# EAGLE design Water_Schematic2_1 (EAGLE 9.5.2)
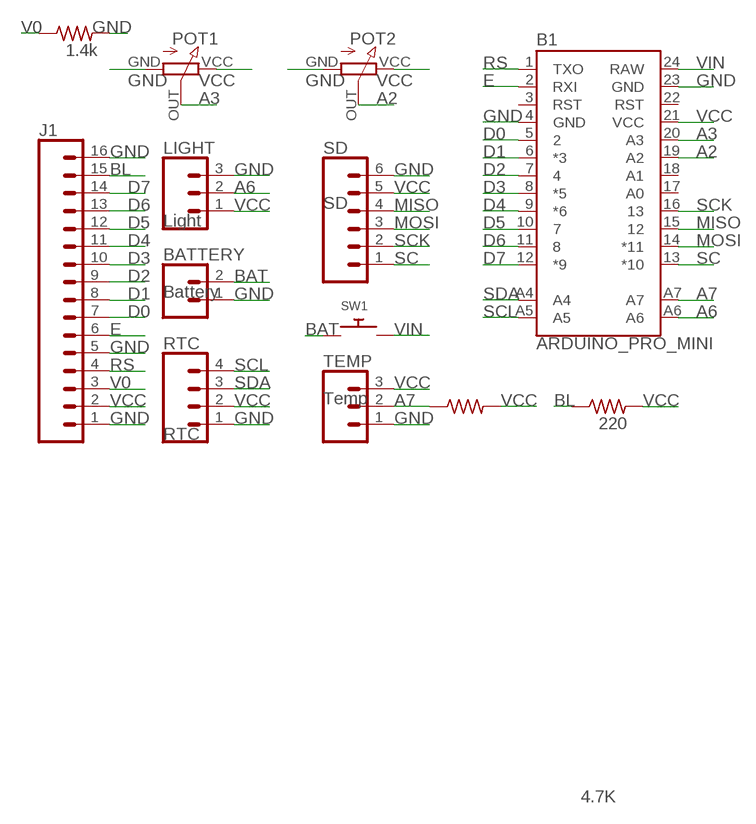
[diagram p0: schematic, sheet 1]

## Parts
B1  ARDUINO_PRO_MINI  [ARDUINO_PRO_MINI]
BATTERY  Battery  CONN_02POLAR  [MOLEX-1X2]
J1  CONN_16  [1X16]
LIGHT  Light  CONN_03  [1X03]
POT1  RM_065  [RM_065]
POT2  RM_065  [RM_065]
R1  4.7K  R-US_0204/7  [0204/7]
R2  220  R-US_0204/7  [0204/7]
R3  1.4k  R-US_0204/7  [0204/7]
RTC  RTC  CONN_04POLAR  [MOLEX-1X4]
SD  SD  CONN_06SILK_FEMALE_PTH  [1X06]
SW1  SWITCH_PUSHBUTTONEVQ-PE  [TACT_PANA-EVQ]
TEMP  Temp  CONN_03  [1X03]

## Nets
A2: B1.19(A2) POT2.OUT
A3: B1.20(A3) POT1.OUT
A6: B1.A6 LIGHT.2
A7: B1.A7 R1.1 TEMP.2
BAT: BATTERY.2 SW1.P$1
BL: J1.15 R2.1
D0: B1.5 J1.7
D1: B1.6(*3) J1.8
D2: B1.7 J1.9
D3: B1.8(*5) J1.10
D4: B1.9(*6) J1.11
D5: B1.10 J1.12
D6: B1.11 J1.13
D7: B1.12(*9) J1.14
E: B1.2(RXI) J1.6
GND: B1.4(GND) B1.23(GND) BATTERY.1 J1.1 J1.5 J1.16 LIGHT.3 POT1.GND(GROUND) POT2.GND(GROUND) R3.2 RTC.1 SD.6 TEMP.1
MISO: B1.15 SD.4
MOSI: B1.14(*11) SD.3
RS: B1.1(TXO) J1.4
SC: B1.13(*10) SD.1
SCK: B1.16 SD.2
SCL: B1.A5 RTC.4
SDA: B1.A4 RTC.3
V0: J1.3 R3.1
VCC: B1.21(VCC) J1.2 LIGHT.1 POT1.VCC POT2.VCC R1.2 R2.2 RTC.2 SD.5 TEMP.3
VIN: B1.24(RAW) SW1.P$2
Unconnected: B1.3(RST) B1.17(A0) B1.18(A1) B1.22(RST)

## Library data of the parts
B1 = SparkFun-Boards_mod:ARDUINO_PRO_MINI: SparkFun Pro Mini Pro Mini compatible footprint. Dimensions: 0.7 x 1.3" PCB Thickness: 0.8mm SparkFun Products: 3.3V/8MHz <https://www.sparkfun.com/products/11114> 5V/16MHz <https://www.sparkfun.com/products/11113>
BATTERY = SparkFun-Connectors:CONN_02: Multi connection point. Often used as Generic Header-pin footprint for 0.1 inch spaced/style header connections On any of the 0.1 inch spaced packages, you can populate with these: Break Away Headers - Straight <https://www.sparkfun.com/products/116> (PRT-00116) Break Away Male Headers - Right Angle <https://www.sparkfun.com/products/553> (PRT-00553) Female Headers <https://www.sparkfun.com/products/115> (PRT-00115) Break Away Headers - Machine Pin <https://www.sparkfun.com/products/117> (PRT-00117) Break Away Female Headers - Swiss Machine Pin <https://www.sparkfun.com/products/743> (PRT-00743) For SCREWTERMINALS and SPRING TERMINALS visit here: Screw Terimnals on SparkFun.com <https://www.sparkfun.com/search/results?term=Screw+Terminals> (5mm/3.5mm/2.54mm spacing) This device is also useful as a general connection point to wire up your design to another part of your project. Our various solder wires solder well into these plated through hole pads. Hook-Up Wire - Assortment (Stranded, 22 AWG) <https://www.sparkfun.com/products/11375> (PRT-11375) Hook-Up Wire - Assortment (Solid Core, 22 AWG) <https://www.sparkfun.com/products/11367> (PRT-11367) View the entire wire category on our website here <https://www.sparkfun.com/categories/141> Special notes: Molex polarized connector foot print use with: PRT-08233 with associated crimp pins and housings. 2.54_SCREWTERM for use with PRT-10571. 3.5mm Screw Terminal footprints for PRT-08084 5mm Screw Terminal footprints for use with PRT-08432; SF_ID: PRT-09918
J1 = SparkFun-Connectors:CONN_16: Multi connection point. Often used as Generic Header-pin footprint for 0.1 inch spaced/style header connections On any of the 0.1 inch spaced packages, you can populate with these: Break Away Headers - Straight <https://www.sparkfun.com/products/116> (PRT-00116) Break Away Male Headers - Right Angle <https://www.sparkfun.com/products/553> (PRT-00553) Female Headers <https://www.sparkfun.com/products/115> (PRT-00115) Break Away Headers - Machine Pin <https://www.sparkfun.com/products/117> (PRT-00117) Break Away Female Headers - Swiss Machine Pin <https://www.sparkfun.com/products/743> (PRT-00743) For SCREWTERMINALS and SPRING TERMINALS visit here: Screw Terimnals on SparkFun.com <https://www.sparkfun.com/search/results?term=Screw+Terminals> (5mm/3.5mm/2.54mm spacing) This device is also useful as a general connection point to wire up your design to another part of your project. Our various solder wires solder well into these plated through hole pads. Hook-Up Wire - Assortment (Stranded, 22 AWG) <https://www.sparkfun.com/products/11375> (PRT-11375) Hook-Up Wire - Assortment (Solid Core, 22 AWG) <https://www.sparkfun.com/products/11367> (PRT-11367) View the entire wire category on our website here <https://www.sparkfun.com/categories/141> Special notes: Molex polarized connector foot print use with SKU : PRT-08231 with associated crimp pins and housings. 1MM SMD Version SKU: PRT-10208 NOTES ON THE VARIANTS LOCK and LOCK_LONGPADS... This footprint was designed to help hold the alignment of a through-hole component (i.e. 6-pin header) while soldering it into place. You may notice that each hole has been shifted either up or down by 0.005 of an inch from it's more standard position (which is a perfectly straight line). This slight alteration caused the pins (the squares in the middle) to touch the edges of the holes. Because they are alternating, it causes a "brace" to hold the component in place. 0.005 has proven to be the perfect amount of "off-center" position when using our standard breakaway headers. Although looks a little odd when you look at the bare footprint, once you have a header in there, the alteration is very hard to notice. Also,if you push a header all the way into place, it is covered up entirely on the bottom side.
LIGHT TEMP = SparkFun-Connectors:CONN_03: Multi connection point. Often used as Generic Header-pin footprint for 0.1 inch spaced/style header connections On any of the 0.1 inch spaced packages, you can populate with these: Break Away Headers - Straight <https://www.sparkfun.com/products/116> (PRT-00116) Break Away Male Headers - Right Angle <https://www.sparkfun.com/products/553> (PRT-00553) Female Headers <https://www.sparkfun.com/products/115> (PRT-00115) Break Away Headers - Machine Pin <https://www.sparkfun.com/products/117> (PRT-00117) Break Away Female Headers - Swiss Machine Pin <https://www.sparkfun.com/products/743> (PRT-00743) Stackable Header - 3 Pin (Female, 0.1") <https://www.sparkfun.com/products/13875> (PRT-13875) For SCREWTERMINALS and SPRING TERMINALS visit here: Screw Terimnals on SparkFun.com <https://www.sparkfun.com/search/results?term=Screw+Terminals> (5mm/3.5mm/2.54mm spacing) This device is also useful as a general connection point to wire up your design to another part of your project. Our various solder wires solder well into these plated through hole pads. Hook-Up Wire - Assortment (Stranded, 22 AWG) <https://www.sparkfun.com/products/11375> (PRT-11375) Hook-Up Wire - Assortment (Solid Core, 22 AWG) <https://www.sparkfun.com/products/11367> (PRT-11367) View the entire wire category on our website here <https://www.sparkfun.com/categories/141> Special notes: Molex polarized connector foot print use with SKU : PRT-08232 with associated crimp pins and housings.; PROD_ID: XXX-00000; VALUE: 455-1750-1-ND
POT1 POT2 = RM_065:RM_065: Small blue and white potentiometer we use in class. RM_065
R1-R3 = rcl:R-US_: RESISTOR, American symbol; SPICEPREFIX: R
RTC = SparkFun-Connectors:CONN_04: Multi connection point. Often used as Generic Header-pin footprint for 0.1 inch spaced/style header connections On any of the 0.1 inch spaced packages, you can populate with these: Break Away Headers - Straight <https://www.sparkfun.com/products/116> (PRT-00116) Break Away Male Headers - Right Angle <https://www.sparkfun.com/products/553> (PRT-00553) Female Headers <https://www.sparkfun.com/products/115> (PRT-00115) Break Away Headers - Machine Pin <https://www.sparkfun.com/products/117> (PRT-00117) Break Away Female Headers - Swiss Machine Pin <https://www.sparkfun.com/products/743> (PRT-00743) For SCREWTERMINALS and SPRING TERMINALS visit here: Screw Terimnals on SparkFun.com <https://www.sparkfun.com/search/results?term=Screw+Terminals> (5mm/3.5mm/2.54mm spacing) This device is also useful as a general connection point to wire up your design to another part of your project. Our various solder wires solder well into these plated through hole pads. Hook-Up Wire - Assortment (Stranded, 22 AWG) <https://www.sparkfun.com/products/11375> (PRT-11375) Hook-Up Wire - Assortment (Solid Core, 22 AWG) <https://www.sparkfun.com/products/11367> (PRT-11367) View the entire wire category on our website here <https://www.sparkfun.com/categories/141> Special notes: Molex polarized connector foot print use with SKU : PRT-08231 with associated crimp pins and housings. 1MM SMD Version SKU: PRT-10208; PROD_ID: CONN-08186; SF_ID: PRT-08231
SD = SparkFun-Connectors:CONN_06: Multi connection point. Often used as Generic Header-pin footprint for 0.1 inch spaced/style header connections On any of the 0.1 inch spaced packages, you can populate with these: Break Away Headers - Straight <https://www.sparkfun.com/products/116> (PRT-00116) Break Away Male Headers - Right Angle <https://www.sparkfun.com/products/553> (PRT-00553) Female Headers <https://www.sparkfun.com/products/115> (PRT-00115) Break Away Headers - Machine Pin <https://www.sparkfun.com/products/117> (PRT-00117) Break Away Female Headers - Swiss Machine Pin <https://www.sparkfun.com/products/743> (PRT-00743) Arduino Stackable Header - 6 Pin <https://www.sparkfun.com/products/9280> (PRT-09280) For SCREWTERMINALS and SPRING TERMINALS visit here: Screw Terimnals on SparkFun.com <https://www.sparkfun.com/search/results?term=Screw+Terminals> (5mm/3.5mm/2.54mm spacing) This device is also useful as a general connection point to wire up your design to another part of your project. Our various solder wires solder well into these plated through hole pads. Hook-Up Wire - Assortment (Stranded, 22 AWG) <https://www.sparkfun.com/products/11375> (PRT-11375) Hook-Up Wire - Assortment (Solid Core, 22 AWG) <https://www.sparkfun.com/products/11367> (PRT-11367) View the entire wire category on our website here <https://www.sparkfun.com/categories/141>; PROD_ID: CONN-08437
SW1 = adafruit:SWITCH_PUSHBUTTON: Buttons SOFTTOUCHSMD_SJ - Soft touch temporary push button (Super Junk Akihabara) Compatible with SKPMANE010 [Mouser: 688-SKPMAN] C&K_KSS = Digikey: KSS221GLFS

## Board
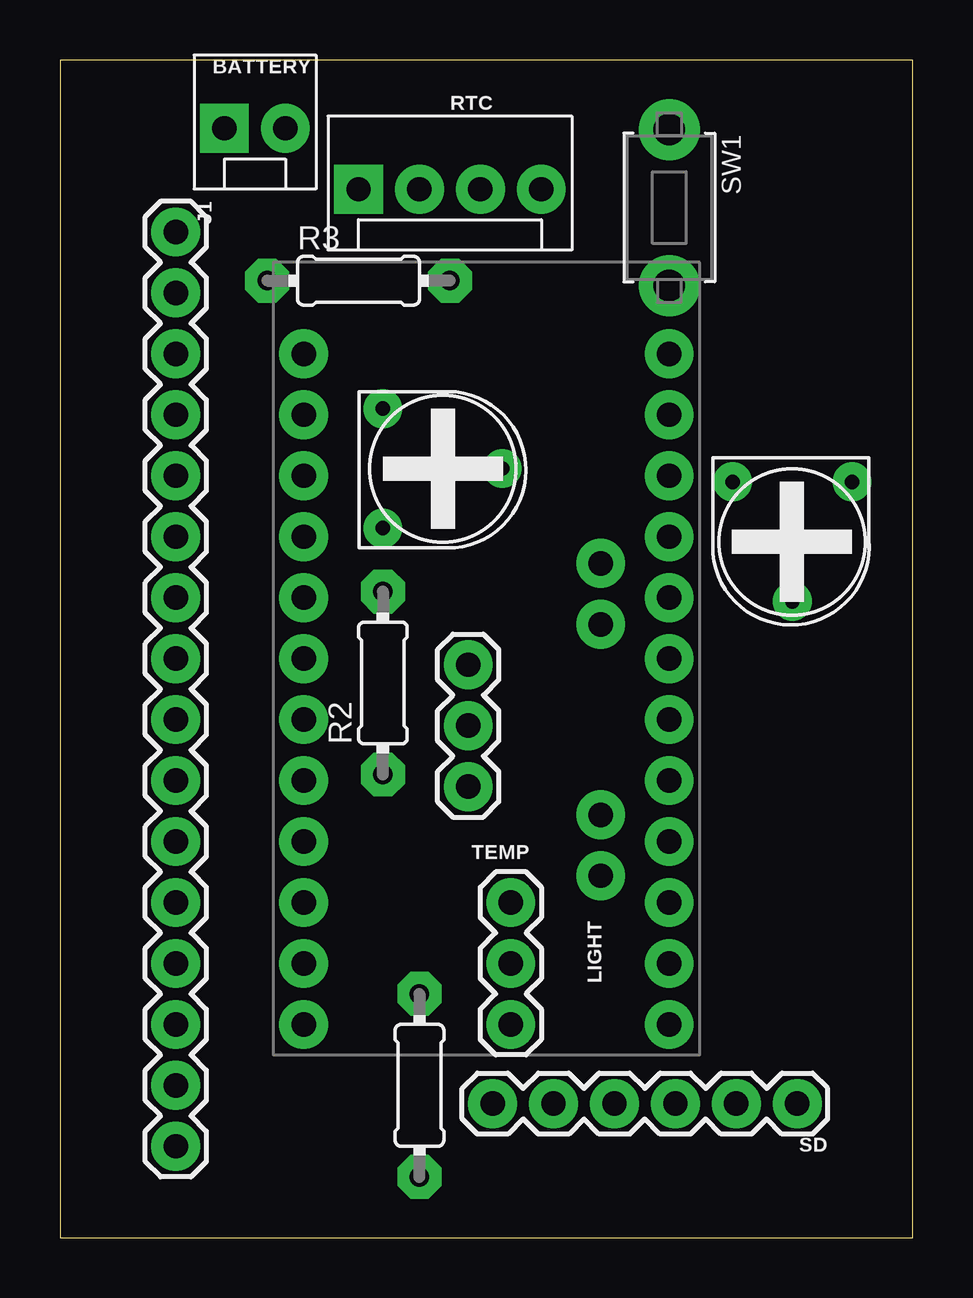
[diagram p1: board, top side]
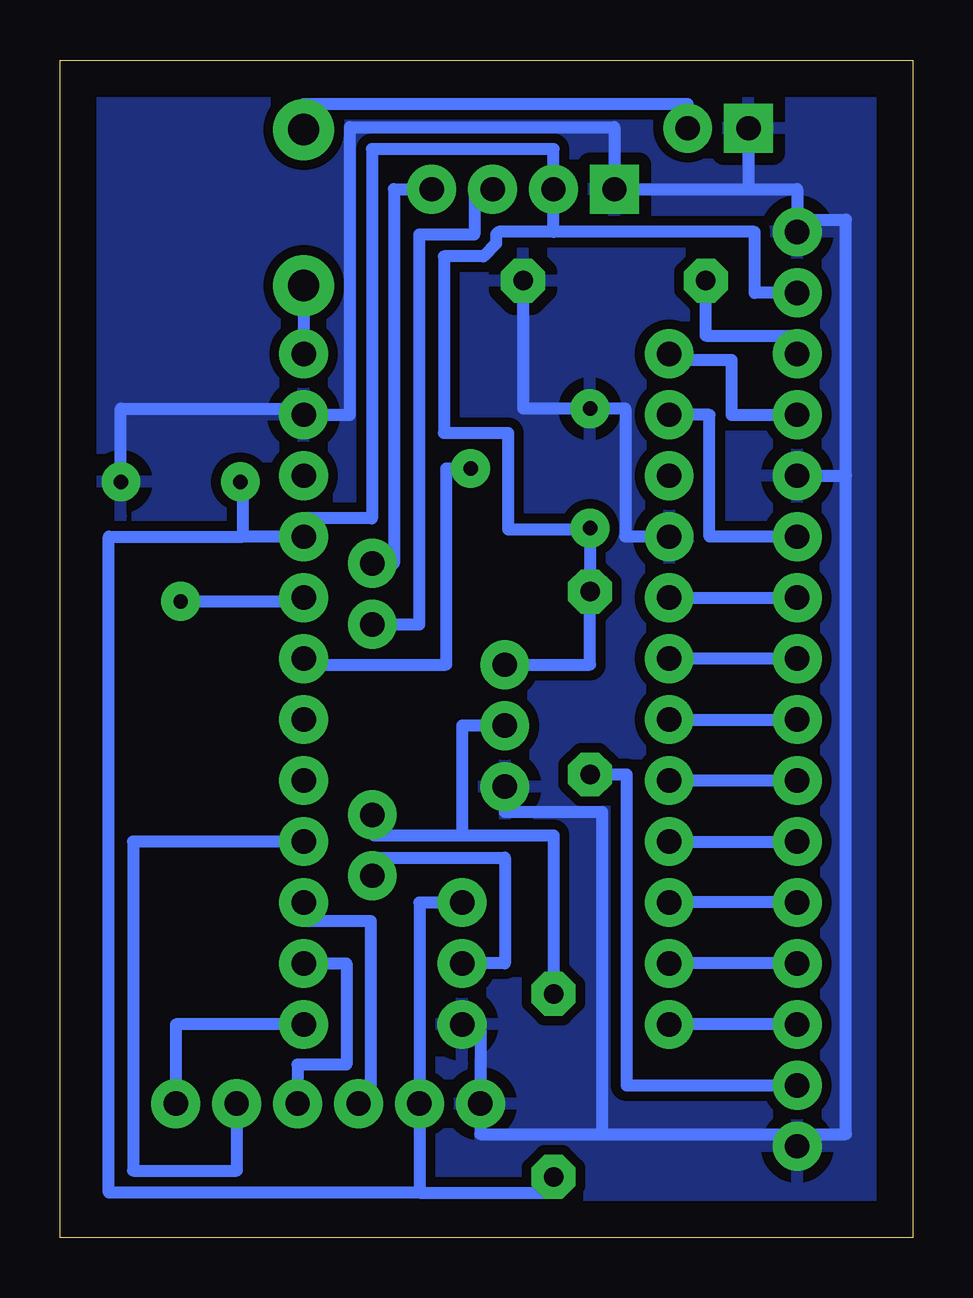
[diagram p2: board, bottom side, seen from below]

Size 35.56 x 49.07 mm. Coordinates in mm from the lower left corner, seen from the top.
Outline: 0,0 35.56,0 35.56,49.07 0,49.07 0,0
Copper layers (1*16): Top 0mil / dielectric 1.5mm / Bottom 0.035mm
Design rules "tad265_drc": minimum track width 20mil, minimum drill 0.35mm, track to track 16mil, track to pad 16mil, pad to pad 16mil, via to via 16mil, smd to smd 16mil, copper to edge 60mil, drill to drill 16mil, minimum pad ring 20mil, minimum via ring 15mil, stop-mask expansion 8mil, vias tented up to drill 0mil, thermal gap 20mil

### Footprints (pad centres in the part's own frame; a part is rotated, then mirrored left to right if it is on the bottom)
ARDUINO_PRO_MINI = drill 1.016 pad 1.88: 1 -7.62,12.7; 2 -7.62,10.16; 3 -7.62,7.62; 4 -7.62,5.08; 5 -7.62,2.54; 6 -7.62,0; 7 -7.62,-2.54; 8 -7.62,-5.08; 9 -7.62,-7.62; 10 -7.62,-10.16; 11 -7.62,-12.7; 12 -7.62,-15.24; 13 7.62,-15.24; 14 7.62,-12.7; 15 7.62,-10.16; 16 7.62,-7.62; 17 7.62,-5.08; 18 7.62,-2.54; 19 7.62,0; 20 7.62,2.54; 21 7.62,5.08; 22 7.62,7.62; 23 7.62,10.16; 24 7.62,12.7; A4 4.763,1.429; A5 4.763,3.969; A6 4.763,-9.049; A7 4.763,-6.509
MOLEX-1X2 = drill 1.016 pad 1.88 square: 1 0,0 | drill 1.016 pad 1.88: 2 2.54,0
1X16 = drill 1.016 pad 1.88: 1 0,0; 2 2.54,0; 3 5.08,0; 4 7.62,0; 5 10.16,0; 6 12.7,0; 7 15.24,0; 8 17.78,0; 9 20.32,0; 10 22.86,0; 11 25.4,0; 12 27.94,0; 13 30.48,0; 14 33.02,0; 15 35.56,0; 16 38.1,0
1X03 = drill 1.016 pad 1.88: 1 0,0; 2 2.54,0; 3 5.08,0
RM_065 = drill 0.6: GND 0,0; OUT 2.489,4.978; VCC 4.978,0
0204/7 = drill 0.813 octagon: 1 -3.81,0; 2 3.81,0
MOLEX-1X4 = drill 1.016 pad 1.88 square: 1 0,0 | drill 1.016 pad 1.88: 2 2.54,0; 3 5.08,0; 4 7.62,0
1X06 = drill 1.016 pad 1.88: 1 0,0; 2 2.54,0; 3 5.08,0; 4 7.62,0; 5 10.16,0; 6 12.7,0
TACT_PANA-EVQ = drill 1.3 pad 2.54: P$1 -3.25,0; P$2 3.25,0

### Placement (x,y rotation side)
B1  17.78,24.13 0 top
BATTERY  6.86,46.23 0 top
J1  4.83,41.91 270 top
LIGHT  18.8,13.97 270 top
POT1  33.02,31.5 180 top
POT2  13.46,34.54 270 top
R1  14.99,6.35 270 top
R2  13.46,23.11 90 top
R3  12.45,39.88 0 top
RTC  12.45,43.69 0 top
SD  30.73,5.59 180 top
SW1  25.4,42.93 270 top
TEMP  17.02,18.8 90 top

### Tracks (layer width: path | path; a pad name or v marks a point on that pad's centre or on a via)
A2
  Bottom 0.508: B1.19 25.4,23.88 19.46,23.88 19.46,32.05 POT2.OUT
A3
  Bottom 0.508: POT1.OUT 25.55,26.52 B1.20
A6
  Bottom 0.508: B1.A6 22.54,15.84 17.02,15.84 17.02,11.43 LIGHT.2
A7
  Bottom 0.508: B1.A7 22.54,16.86 22.45,16.76 18.8,16.76 | 18.8,16.76 14.99,16.76 R1.1 | TEMP.2 18.8,21.34 18.8,16.76
BAT
  Bottom 0.508: SW1.P$1 25.4,47.24 9.4,47.24 BATTERY.2
BL
  Bottom 0.508: R2.1 11.94,19.3 11.94,6.35 J1.15
D0
  Bottom 0.508: B1.5 J1.7
D1
  Bottom 0.508: J1.8 B1.6
D2
  Bottom 0.508: B1.7 J1.9
D3
  Bottom 0.508: J1.10 B1.8
D4
  Bottom 0.508: B1.9 J1.11
D5
  Bottom 0.508: J1.12 B1.10
D6
  Bottom 0.508: J1.13 B1.11
D7
  Bottom 0.508: J1.14 B1.12
E
  Bottom 0.508: B1.2 8.48,34.29 8.48,29.21 J1.6
GND
  Bottom 0.508: 6.86,43.69 RTC.1 12.45,46.28 23.47,46.28 23.47,34.29 B1.23 25.65,34.54 33.02,34.54 POT1.GND | 2.79,31.75 2.79,4.32 4.83,4.32 | 2.79,31.75 2.79,42.42 4.83,42.42 J1.1 4.83,43.69 6.86,43.69 | 12.95,4.32 4.83,4.32 | 4.83,4.32 J1.16 | B1.4 11.99,29.21 11.99,34.54 POT2.GND 16.26,34.54 R3.2 | SD.6 18.03,4.32 12.95,4.32 | LIGHT.3 18.03,8.89 SD.6 | 18.03,5.33 SD.6 | BATTERY.1 6.86,43.69 | J1.5 2.79,31.75 | TEMP.1 17.02,17.73 12.95,17.73 12.95,4.32
  pour Bottom: 0,49.02 35.56,49.02 35.56,0 0,0
MISO
  Bottom 0.508: B1.15 25.4,13.21 22.61,13.21 22.61,5.59 SD.4
MOSI
  Bottom 0.508: B1.14 23.62,11.43 23.62,7.21 25.65,7.21 SD.3
RS
  Bottom 0.508: J1.4 7.57,34.29 7.57,36.58 10.16,36.58 B1.1
SC
  Bottom 0.508: B1.13 30.73,8.89 SD.1
SCK
  Bottom 0.508: B1.16 32.51,16.51 32.51,2.79 28.19,2.79 SD.2
SCL
  Bottom 0.508: RTC.4 21.64,43.69 21.64,28.1 B1.A5
SDA
  Bottom 0.508: B1.A4 20.57,25.56 20.57,41.81 18.29,41.81 18.29,43.69 RTC.3
V0
  Bottom 0.508: J1.3 4.83,37.59 8.64,37.59 R3.1
VCC
  Bottom 0.508: LIGHT.1 20.57,13.97 SD.5 20.57,1.88 | 20.57,1.88 33.53,1.88 33.53,29.21 27.94,29.21 | POT1.VCC 27.94,31.5 27.94,29.21 | 27.94,29.21 B1.21 25.4,29.97 22.55,29.97 22.55,45.36 14.99,45.36 RTC.2 14.99,41.91 | 20.57,1.88 15.14,1.88 14.99,2.03 R1.2 | J1.2 6.6,39.37 6.6,41.91 14.99,41.91 | 14.99,41.91 17.27,41.91 17.37,41.81 17.37,41.43 17.91,40.89 19.56,40.89 19.56,33.53 16.88,33.53 16.88,29.52 13.51,29.52 POT2.VCC R2.2 13.46,23.88 TEMP.3
VIN
  Bottom 0.508: SW1.P$2 B1.24